# EAGLE schematic arrayboard_r0a (EAGLE 6.5.0)
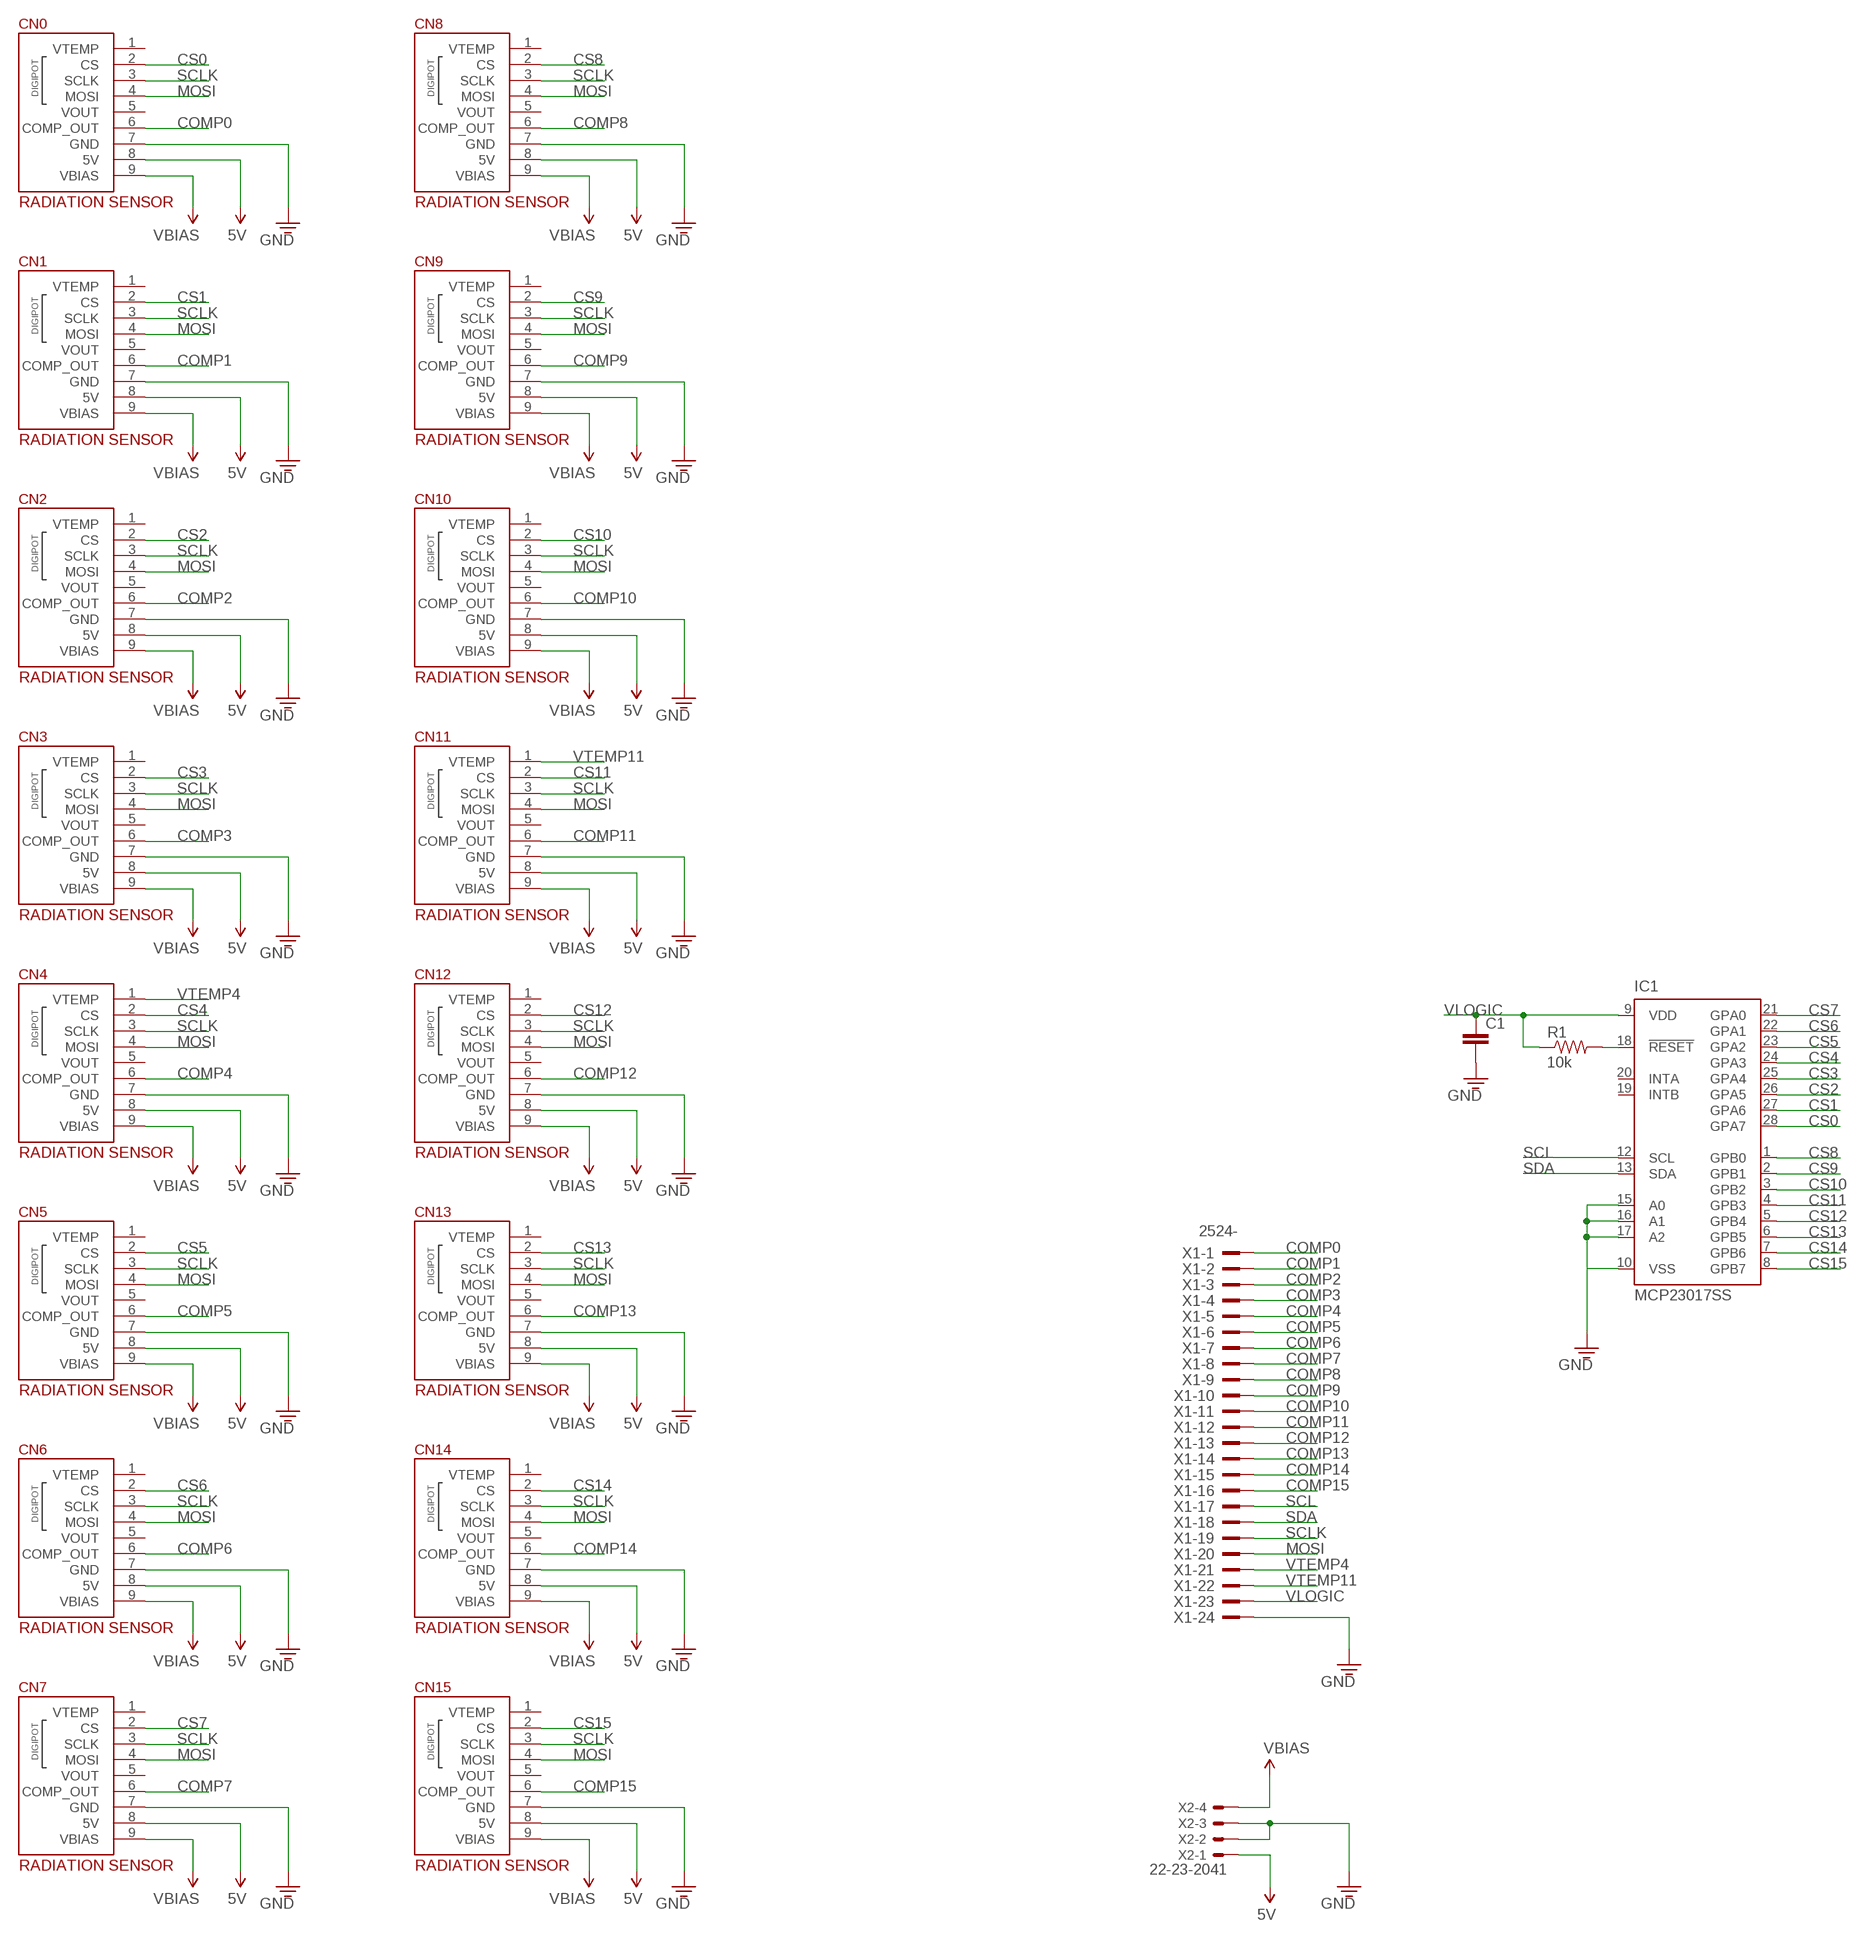
[diagram p0: schematic, sheet 1]

## Parts
C1  CAP0603  [0603]
CN0  RADIATION-SENSOR-REV1  [RADIATION-SENSOR-REV1]
CN1  RADIATION-SENSOR-REV1  [RADIATION-SENSOR-REV1]
CN2  RADIATION-SENSOR-REV1  [RADIATION-SENSOR-REV1]
CN3  RADIATION-SENSOR-REV1  [RADIATION-SENSOR-REV1]
CN4  RADIATION-SENSOR-REV1  [RADIATION-SENSOR-REV1]
CN5  RADIATION-SENSOR-REV1  [RADIATION-SENSOR-REV1]
CN6  RADIATION-SENSOR-REV1  [RADIATION-SENSOR-REV1]
CN7  RADIATION-SENSOR-REV1  [RADIATION-SENSOR-REV1]
CN8  RADIATION-SENSOR-REV1  [RADIATION-SENSOR-REV1]
CN9  RADIATION-SENSOR-REV1  [RADIATION-SENSOR-REV1]
CN10  RADIATION-SENSOR-REV1  [RADIATION-SENSOR-REV1]
CN11  RADIATION-SENSOR-REV1  [RADIATION-SENSOR-REV1]
CN12  RADIATION-SENSOR-REV1  [RADIATION-SENSOR-REV1]
CN13  RADIATION-SENSOR-REV1  [RADIATION-SENSOR-REV1]
CN14  RADIATION-SENSOR-REV1  [RADIATION-SENSOR-REV1]
CN15  RADIATION-SENSOR-REV1  [RADIATION-SENSOR-REV1]
IC1  MCP23017SS  [SSOP28]
R1  10k  RESISTOR0603  [0603]
X1  2524-  [PAK100/2500-24]
X2  22-23-2041  [22-23-2041]

## Nets
5V: CN0.8(5V) CN1.8(5V) CN2.8(5V) CN3.8(5V) CN4.8(5V) CN5.8(5V) CN6.8(5V) CN7.8(5V) CN8.8(5V) CN9.8(5V) CN10.8(5V) CN11.8(5V) CN12.8(5V) CN13.8(5V) CN14.8(5V) CN15.8(5V) X2.1
COMP0: CN0.6(COMP_OUT) X1.1
COMP1: CN1.6(COMP_OUT) X1.2
COMP2: CN2.6(COMP_OUT) X1.3
COMP3: CN3.6(COMP_OUT) X1.4
COMP4: CN4.6(COMP_OUT) X1.5
COMP5: CN5.6(COMP_OUT) X1.6
COMP6: CN6.6(COMP_OUT) X1.7
COMP7: CN7.6(COMP_OUT) X1.8
COMP8: CN8.6(COMP_OUT) X1.9
COMP9: CN9.6(COMP_OUT) X1.10
COMP10: CN10.6(COMP_OUT) X1.11
COMP11: CN11.6(COMP_OUT) X1.12
COMP12: CN12.6(COMP_OUT) X1.13
COMP13: CN13.6(COMP_OUT) X1.14
COMP14: CN14.6(COMP_OUT) X1.15
COMP15: CN15.6(COMP_OUT) X1.16
CS0: CN0.2(CS) IC1.28(GPA7)
CS1: CN1.2(CS) IC1.27(GPA6)
CS2: CN2.2(CS) IC1.26(GPA5)
CS3: CN3.2(CS) IC1.25(GPA4)
CS4: CN4.2(CS) IC1.24(GPA3)
CS5: CN5.2(CS) IC1.23(GPA2)
CS6: CN6.2(CS) IC1.22(GPA1)
CS7: CN7.2(CS) IC1.21(GPA0)
CS8: CN8.2(CS) IC1.1(GPB0)
CS9: CN9.2(CS) IC1.2(GPB1)
CS10: CN10.2(CS) IC1.3(GPB2)
CS11: CN11.2(CS) IC1.4(GPB3)
CS12: CN12.2(CS) IC1.5(GPB4)
CS13: CN13.2(CS) IC1.6(GPB5)
CS14: CN14.2(CS) IC1.7(GPB6)
CS15: CN15.2(CS) IC1.8(GPB7)
GND: C1.2 CN0.7(GND) CN1.7(GND) CN2.7(GND) CN3.7(GND) CN4.7(GND) CN5.7(GND) CN6.7(GND) CN7.7(GND) CN8.7(GND) CN9.7(GND) CN10.7(GND) CN11.7(GND) CN12.7(GND) CN13.7(GND) CN14.7(GND) CN15.7(GND) IC1.10(VSS) IC1.15(A0) IC1.16(A1) IC1.17(A2) X1.24 X2.2 X2.3
MOSI: CN0.4(MOSI) CN1.4(MOSI) CN2.4(MOSI) CN3.4(MOSI) CN4.4(MOSI) CN5.4(MOSI) CN6.4(MOSI) CN7.4(MOSI) CN8.4(MOSI) CN9.4(MOSI) CN10.4(MOSI) CN11.4(MOSI) CN12.4(MOSI) CN13.4(MOSI) CN14.4(MOSI) CN15.4(MOSI) X1.20
N$2: IC1.18(!RESET) R1.2
SCL: IC1.12(SCL) X1.17
SCLK: CN0.3(SCLK) CN1.3(SCLK) CN2.3(SCLK) CN3.3(SCLK) CN4.3(SCLK) CN5.3(SCLK) CN6.3(SCLK) CN7.3(SCLK) CN8.3(SCLK) CN9.3(SCLK) CN10.3(SCLK) CN11.3(SCLK) CN12.3(SCLK) CN13.3(SCLK) CN14.3(SCLK) CN15.3(SCLK) X1.19
SDA: IC1.13(SDA) X1.18
VBIAS: CN0.9(VBIAS) CN1.9(VBIAS) CN2.9(VBIAS) CN3.9(VBIAS) CN4.9(VBIAS) CN5.9(VBIAS) CN6.9(VBIAS) CN7.9(VBIAS) CN8.9(VBIAS) CN9.9(VBIAS) CN10.9(VBIAS) CN11.9(VBIAS) CN12.9(VBIAS) CN13.9(VBIAS) CN14.9(VBIAS) CN15.9(VBIAS) X2.4
VLOGIC: C1.1 IC1.9(VDD) R1.1 X1.23
VTEMP4: CN4.1(VTEMP) X1.21
VTEMP11: CN11.1(VTEMP) X1.22
Unconnected: CN0.1(VTEMP) CN0.5(VOUT) CN1.1(VTEMP) CN1.5(VOUT) CN2.1(VTEMP) CN2.5(VOUT) CN3.1(VTEMP) CN3.5(VOUT) CN4.5(VOUT) CN5.1(VTEMP) CN5.5(VOUT) CN6.1(VTEMP) CN6.5(VOUT) CN7.1(VTEMP) CN7.5(VOUT) CN8.1(VTEMP) CN8.5(VOUT) CN9.1(VTEMP) CN9.5(VOUT) CN10.1(VTEMP) CN10.5(VOUT) CN11.5(VOUT) CN12.1(VTEMP) CN12.5(VOUT) CN13.1(VTEMP) CN13.5(VOUT) CN14.1(VTEMP) CN14.5(VOUT) CN15.1(VTEMP) CN15.5(VOUT) IC1.19(INTB) IC1.20(INTA)

## Library data of the parts
C1 = openct:CAP: Capacitor Standard 0603 ceramic capacitor, and 0.1" leaded capacitor.
CN0 CN1-CN15 = openct:RADIATION-SENSOR-REV1: Header for Radiation Sensor (rev1)
IC1 = adafruit:MCP23017: http://ww1.microchip.com/downloads/en/DeviceDoc/21952a.pdf Source: http://ww1.microchip.com/downloads/en/DeviceDoc/21952a.pdf
R1 = openct:RESISTOR: Resistor Basic schematic elements and footprints for 0603, 1206, and PTH 1/10th watt (small) resistors.
X1 = con-3m:2524-: 3M (TM) Pak 100 4-Wall Header Source: 3M; OC_FARNELL: unknown; OC_NEWARK: unknown
X2 = con-molex:22-23-2041: .100" (2.54mm) Center Header - 4 Pin; MF: MOLEX; MPN: 22-23-2041; OC_FARNELL: 1462920; OC_NEWARK: 38C0355